# EAGLE board Mainboard v4 (EAGLE 7.2.0), part 1 of 2
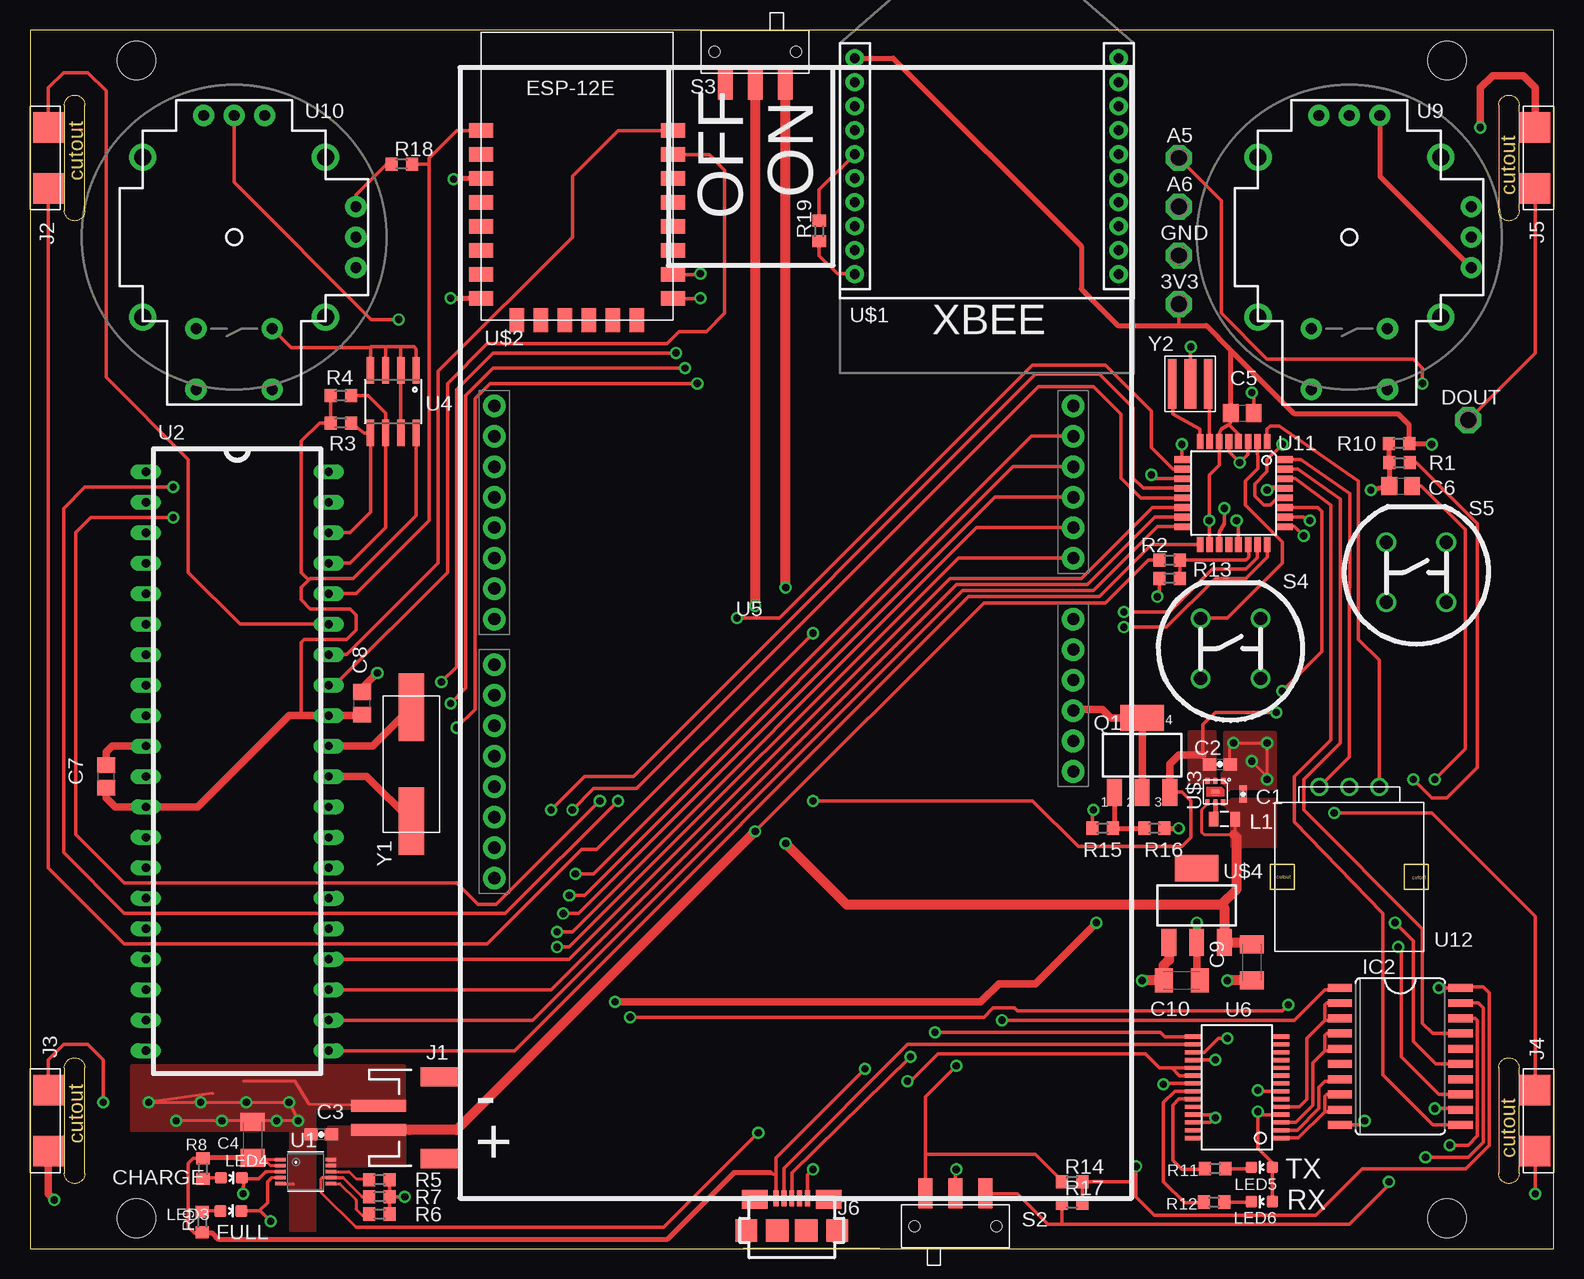
[diagram p2: board, top side]
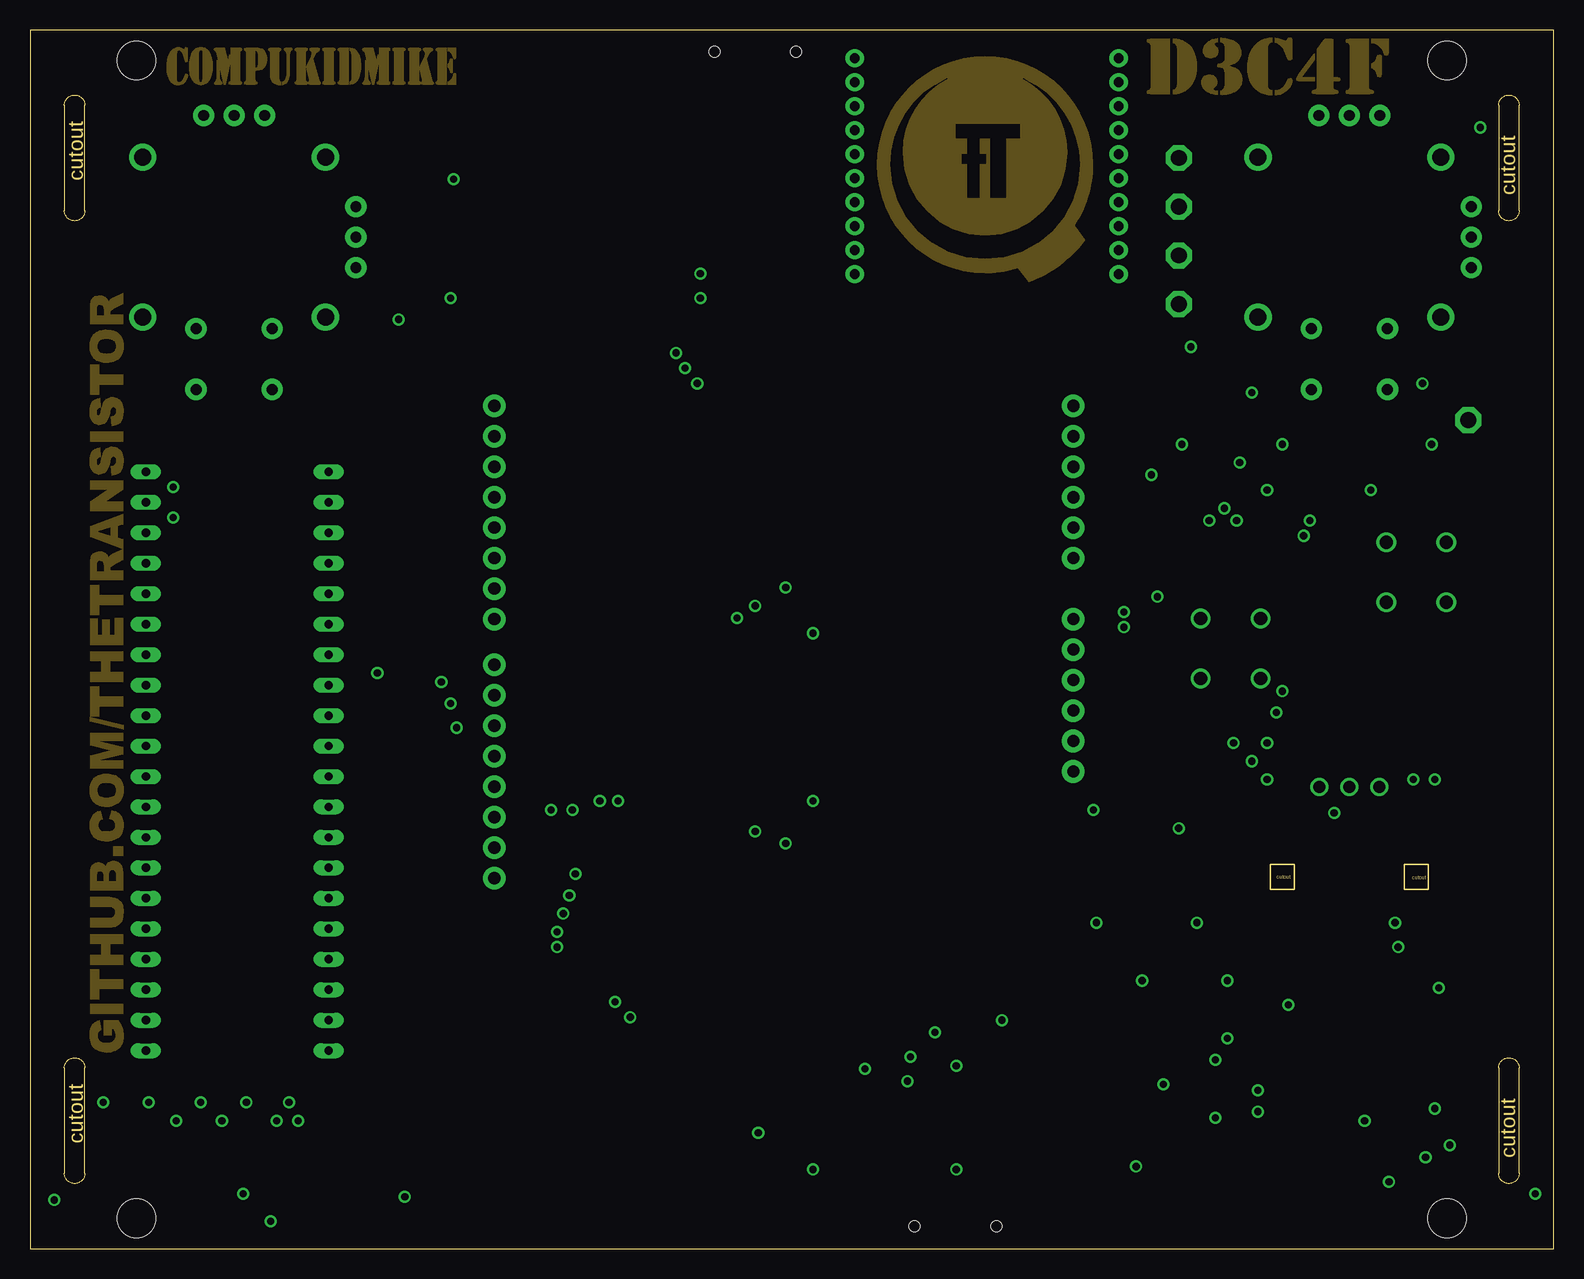
[diagram p3: board, inner layer Route15]
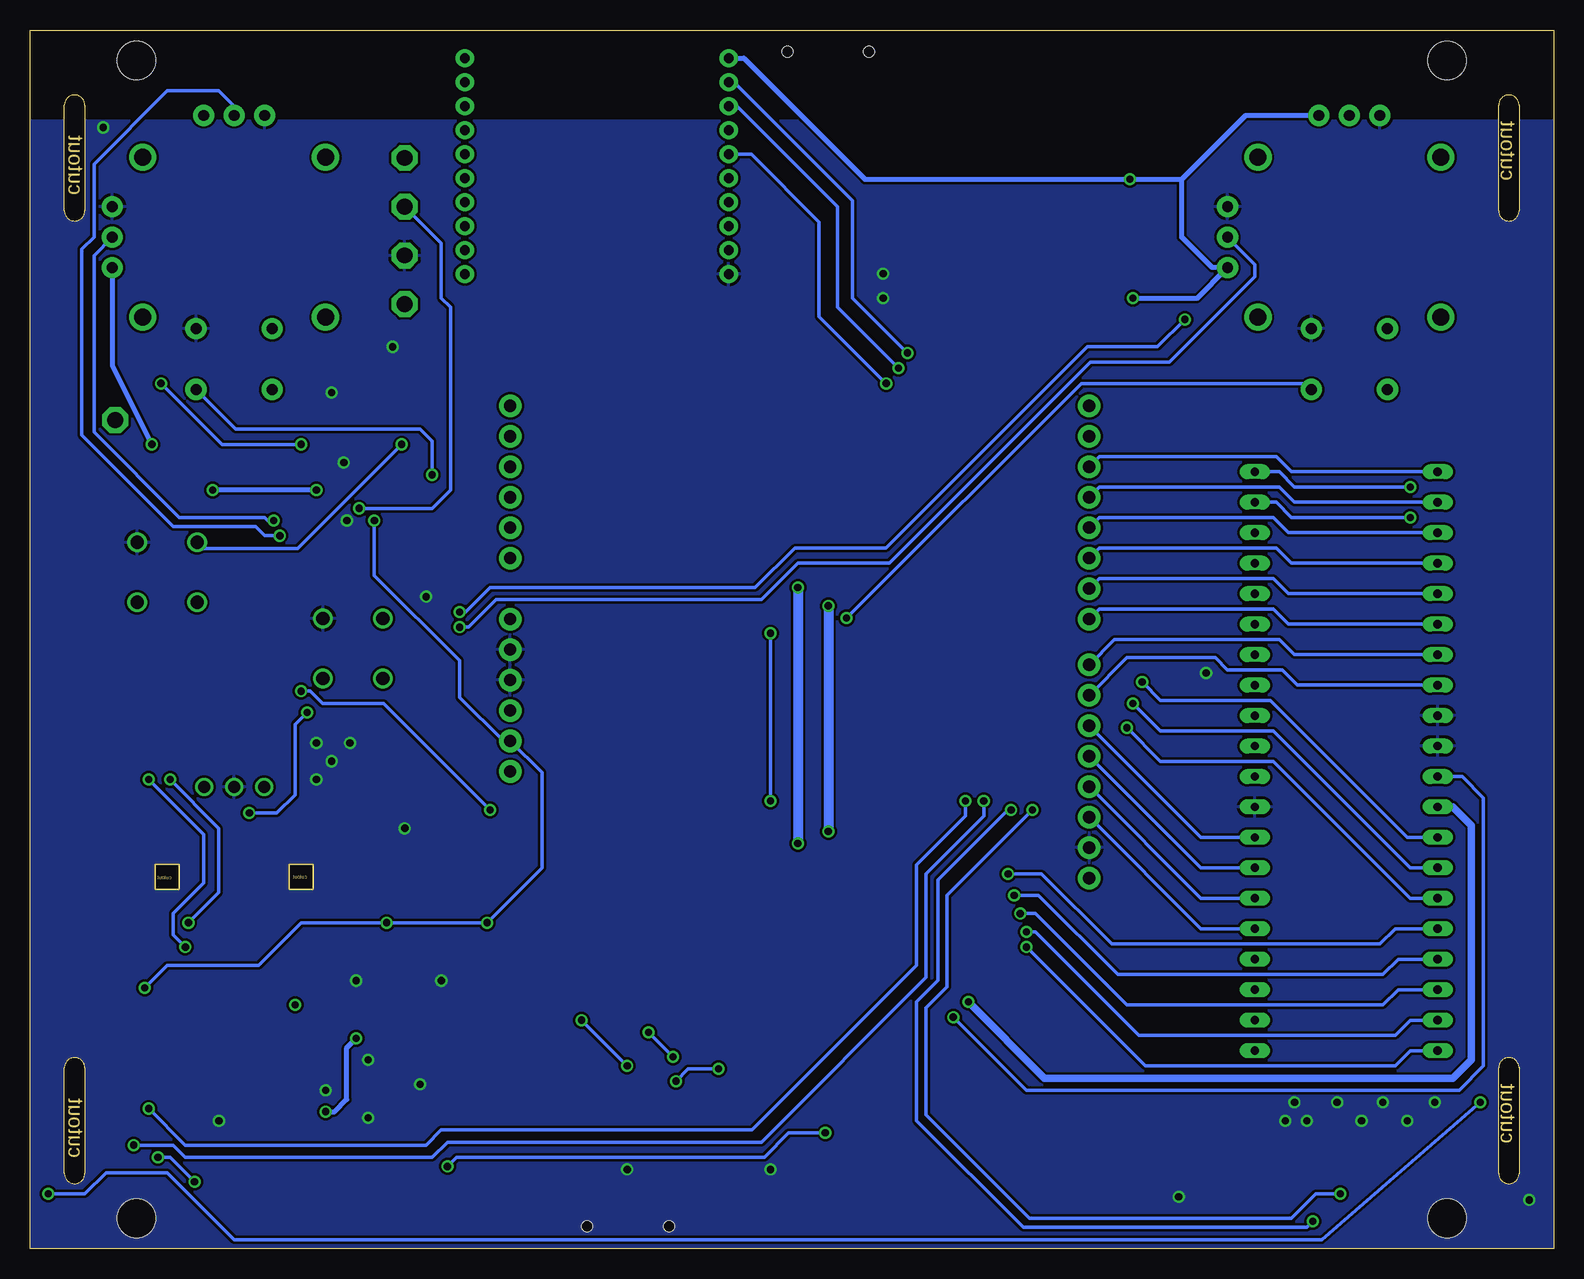
[diagram p4: board, bottom side, seen from below]

Size 127 x 101.6 mm. Coordinates in mm from the lower left corner, seen from the top.
Outline: 0,0 127,0 127,101.6 0,101.6 0,0
Copper layers (1+2*14+15+16): Top 0.035mm / dielectric 1.5mm / Route2 0.035mm / dielectric 0.15mm / Route14 0.035mm / dielectric 0.15mm / Route15 0.035mm / dielectric 0.2mm / Bottom 0.035mm
Design rules "default *": minimum track width 10mil, minimum drill 12mil, track to track 8mil, track to pad 8mil, pad to pad 6mil, via to via 8mil, smd to smd 8mil, copper to edge 0.002540625mm, drill to drill 8mil, minimum pad ring 10mil, minimum via ring 8mil, stop-mask expansion 4mil, vias tented up to drill 0mil, thermal gap 10mil
Holes 3.2 mm at 8.89,99.06 118.11,99.06 118.11,2.54 8.89,2.54

## Footprints (pad centres in the part's own frame; a part is rotated, then mirrored left to right if it is on the bottom)
P1-13 = drill 1.321 pad 2.159 octagon: TP 0,0
0402-CAP = smd 0.45 x 0.6: 1 -0.48,0; 2 0.49,0
0603-CAP = smd 1.1 x 1: 1 -0.85,0; 2 0.85,0
C1206K = smd 1.5 x 2: 1 -1.5,0; 2 1.5,0
C0805 = smd 1.3 x 1.5: 1 -0.95,0; 2 0.95,0
SO20W = smd 0.66 x 2.032: 1 -5.715,-5.029; 2 -4.445,-5.029; 3 -3.175,-5.029; 4 -1.905,-5.029; 5 -0.635,-5.029; 6 0.635,-5.029; 7 1.905,-5.029; 8 3.175,-5.029; 9 4.445,-5.029; 10 5.715,-5.029; 11 5.715,5.029; 12 4.445,5.029; 13 3.175,5.029; 14 1.905,5.029; 15 0.635,5.029; 16 -0.635,5.029; 17 -1.905,5.029; 18 -3.175,5.029; 19 -4.445,5.029; 20 -5.715,5.029
JST-2-SMD = smd 1 x 4.6: 1 -1,-3.7; 2 1,-3.7 | smd 1.6 x 3.4: NC1 -3.4,1.5; NC2 3.4,1.5
SMD-2-SMALL = smd 2.54 x 2.54: P$1 -2.54,0.254; P$2 2.54,0.254
CON2_USB_MICRO_B_AT = smd 0.406 x 1.346: P1 -1.321,2.692; P2 -0.66,2.692; P3 0,2.692; P4 0.66,2.692; P5 1.321,2.692 | smd 1.8 x 1.9: S1 -3.802,0; S2 3.802,0 | smd 2.1 x 1.6: S3 -3.089,2.592; S4 3.089,2.592 | smd 1.9 x 1.9: S5 -1.216,0; S6 1.216,0
0805 = smd 0.8 x 1.2: 1 -0.9,0; 2 0.9,0
LED-0603 = smd 1 x 1: A 0,-0.877; C 0,0.877
SOT223 = smd 1.219 x 2.235: 1 -2.311,-3.099; 2 0,-3.099; 3 2.311,-3.099 | smd 3.6 x 2.2: 4 0,3.099
R0603 = smd 1 x 1.1: 1 -0.85,0; 2 0.85,0
SAQN = smd 1.2 x 2.5: 1 -2.5,1.25; 2 0,1.25; 3 2.5,1.25 | hole 0.9: -3.4,-1.5; 3.4,-1.5
TACTILE-PTH-LARGE = drill 1.1: P$1 -2.5,2.5; P$2 2.5,2.5; P$3 2.5,-2.5; P$4 -2.5,-2.5
MSOP-10 = smd 0.305 x 0.889: 1 -1,-2.11; 2 -0.5,-2.11; 3 0,-2.11; 4 0.5,-2.11; 5 1,-2.11; 6 1,2.11; 7 0.5,2.11; 8 0,2.11; 9 -0.5,2.11; 10 -1,2.11
DIP-40 = drill 0.7 pad 1.27 long: 1 -7.62,24.13; 2 -7.62,21.59; 3 -7.62,19.05; 4 -7.62,16.51; 5 -7.62,13.97; 6 -7.62,11.43; 7 -7.62,8.89; 8 -7.62,6.35; 9 -7.62,3.81; 10 -7.62,1.27; 11 -7.62,-1.27; 12 -7.62,-3.81; 13 -7.62,-6.35; 14 -7.62,-8.89; 15 -7.62,-11.43; 16 -7.62,-13.97; 17 -7.62,-16.51; 18 -7.62,-19.05; 19 -7.62,-21.59; 20 -7.62,-24.13; 21 7.62,-24.13; 22 7.62,-21.59; 23 7.62,-19.05; 24 7.62,-16.51; 25 7.62,-13.97; 26 7.62,-11.43; 27 7.62,-8.89; 28 7.62,-6.35; 29 7.62,-3.81; 30 7.62,-1.27; 31 7.62,1.27; 32 7.62,3.81; 33 7.62,6.35; 34 7.62,8.89; 35 7.62,11.43; 36 7.62,13.97; 37 7.62,16.51; 38 7.62,19.05; 39 7.62,21.59; 40 7.62,24.13
SO08 = smd 0.61 x 2.21: 1 -1.905,-2.616; 2 -0.635,-2.616; 3 0.635,-2.616; 4 1.905,-2.616; 5 1.905,2.616; 6 0.635,2.616; 7 -0.635,2.616; 8 -1.905,2.616
3.6TFT-LCD-SHIELD = drill 1.016 pad 1.88: 3.3V 49.63,12.61; 5V 49.63,15.15; A0 49.63,27.85; A1 49.63,30.39; A2 49.63,32.93; A3 49.63,35.47; A4 49.63,38.01; A5 49.63,40.55; AREF 1.37,1.18; D2 1.37,35.47; D3 1.37,32.93; D4 1.37,30.39; D5 1.37,27.85; D6 1.37,25.31; D7 1.37,22.77; D8 1.37,18.96; D9 1.37,16.42; D10 1.37,13.88; D11 1.37,11.34; D12 1.37,8.8; D13 1.37,6.26; GND@0 49.63,17.69; GND@1 49.63,20.23; GND@2 1.37,3.72; RES 49.63,10.07; RX 1.37,40.55; TX 1.37,38.01; VIN 49.63,22.77
SSOP28DB = smd 0.348 x 1.397: 1 -4.225,-3.656; 2 -3.575,-3.656; 3 -2.925,-3.656; 4 -2.275,-3.656; 5 -1.625,-3.656; 6 -0.975,-3.656; 7 -0.325,-3.656; 8 0.325,-3.656; 9 0.975,-3.656; 10 1.625,-3.656; 11 2.275,-3.656; 12 2.925,-3.656; 13 3.575,-3.656; 14 4.225,-3.656; 15 4.225,3.656; 16 3.575,3.656; 17 2.925,3.656; 18 2.275,3.656; 19 1.625,3.656; 20 0.975,3.656; 21 0.325,3.656; 22 -0.325,3.656; 23 -0.975,3.656; 24 -1.625,3.656; 25 -2.275,3.656; 26 -2.925,3.656; 27 -3.575,3.656; 28 -4.225,3.656
JOYSTICK = drill 0.9 pad 1.778: B1A -3.175,12.7; B1B 3.175,12.7; B2A -3.175,7.62; B2B 3.175,7.62 | drill 0.889 pad 1.778: H1 -2.54,-10.16; H2 0,-10.16; H3 2.54,-10.16; V1 -10.16,2.54; V2 -10.16,0; V3 -10.16,-2.54 | drill 1.397 pad 2.286: MOUNT1 -7.62,6.668; MOUNT2 -7.62,-6.668; MOUNT3 7.62,-6.668; MOUNT4 7.62,6.668
TQFP32-08 = smd 1.27 x 0.559: 1 -4.293,2.8; 2 -4.293,2; 3 -4.293,1.2; 4 -4.293,0.4; 5 -4.293,-0.4; 6 -4.293,-1.2; 7 -4.293,-2; 8 -4.293,-2.8; 17 4.293,-2.8; 18 4.293,-2; 19 4.293,-1.2; 20 4.293,-0.4; 21 4.293,0.4; 22 4.293,1.2; 23 4.293,2; 24 4.293,2.8 | smd 0.559 x 1.27: 9 -2.8,-4.293; 10 -2,-4.293; 11 -1.2,-4.293; 12 -0.4,-4.293; 13 0.4,-4.293; 14 1.2,-4.293; 15 2,-4.293; 16 2.8,-4.293; 25 2.8,4.293; 26 2,4.293; 27 1.2,4.293; 28 0.4,4.293; 29 -0.4,4.293; 30 -1.2,4.293; 31 -2,4.293; 32 -2.8,4.293
ENCODER-12MM-VERT-SQ = drill 1: P$1 -2.5,-7.5; P$2 0,-7.5; P$3 2.5,-7.5
XBEE-SILK = drill 0.8 pad 1.524: 1 -11,20; 2 -11,18; 3 -11,16; 4 -11,14; 5 -11,12; 6 -11,10; 7 -11,8; 8 -11,6; 9 -11,4; 10 -11,2; 11 11,2; 12 11,4; 13 11,6; 14 11,8; 15 11,10; 16 11,12; 17 11,14; 18 11,16; 19 11,18; 20 11,20
ESP8266-ESP12E = smd 2 x 1.2: 1 16,1.8; 2 16,3.8; 3 16,5.8; 4 16,7.8; 5 16,9.8; 6 16,11.8; 7 16,13.8; 8 16,15.8; 9 0,15.8; 10 0,13.8; 11 0,11.8; 12 0,9.8; 13 0,7.8; 14 0,5.8; 15 0,3.8; 16 0,1.8 | smd 1.2 x 2: P$1 13,0; P$2 11,0; P$3 9,0; P$4 7,0; P$5 5,0; P$6 3,0
6-UMLP = smd 0.35 x 0.5: P$1 -0.65,-0.9; P$2 0,-0.9; P$3 0.65,-0.9; P$4 0.65,0.9; P$5 0,0.9; P$6 -0.65,0.9 | smd 0.61 x 0.305: THERMAL 0,0
CRYSTAL-SMD = smd 5.6 x 2.1: P$1 -4.75,0; P$2 4.75,0
RESONATOR-AWSCR-CV = smd 0.7 x 4.1: P$1 -1.5,0; P$3 1.5,0 | smd 1 x 4.1: P$2 0,0

## Placement (x,y rotation side)
3V3  TPPAD1-13  [P1-13]  95.76,78.74 0 top
A5  TPPAD1-13  [P1-13]  95.76,90.93 0 top
A6  TPPAD1-13  [P1-13]  95.76,86.87 0 top
C1  2.2uF  [0402-CAP]  101.13,37.91 270 top
C2  4.7uF  [0603-CAP]  99.19,40.39 0 top
C3  4.7uF  [0603-CAP]  24.28,9.52 180 top
C4  10uF  [C1206K]  18.56,9.06 90 top
C5  0.1uF  [C0805]  101.06,69.67 0 top
C6  0.1uF  [C0805]  114.26,63.59 0 top
C7  0.1uF  [C0805]  6.35,39.37 90 top
C8  0.1uF  [C0805]  27.69,45.47 90 top
C9  1uF  [C1206K]  101.85,23.88 270 top
C10  1uF  [C1206K]  96.01,22.35 180 top
DOUT  TPPAD1-13  [P1-13]  119.89,69.09 0 top
GND  TPPAD1-13  [P1-13]  95.76,82.8 0 top
IC2  74LS244DW  [SO20W]  114.22,16.03 270 top
J1  [JST-2-SMD]  32.77,10.92 270 top
J2  BOARD-EDGE-CONN-SMDSMALL  [SMD-2-SMALL]  1.27,90.93 270 top
J3  BOARD-EDGE-CONN-SMDSMALL  [SMD-2-SMALL]  1.27,10.67 270 top
J4  BOARD-EDGE-CONN-SMDSMALL  [SMD-2-SMALL]  125.73,10.67 90 top
J5  BOARD-EDGE-CONN-SMDSMALL  [SMD-2-SMALL]  125.73,90.93 90 top
J6  MYCON2_USB-MINI-B  [CON2_USB_MICRO_B_AT]  63.5,1.52 0 top
L1  [0805]  99.57,35.81 180 top
LED3  GRN  [LED-0603]  16.74,3.14 270 top
LED4  RED  [LED-0603]  16.79,5.91 270 top
LED5  GRN  [LED-0603]  102.69,6.79 90 top
LED6  GRN  [LED-0603]  102.69,3.93 90 top
Q1  BSP170P  [SOT223]  92.71,41.15 0 top
R1  10K  [R0603]  114.16,65.53 0 top
R2  10K  [R0603]  95,57.4 180 top
R3  10K  [R0603]  25.91,68.83 180 top
R4  10K  [R0603]  25.91,71.12 180 top
R5  10K  [R0603]  29.14,5.76 180 top
R6  2K  [R0603]  29.14,2.89 180 top
R7  10K  [R0603]  29.14,4.34 180 top
R8  360  [R0603]  14.41,6.67 90 top
R9  360  [R0603]  14.37,2.24 270 top
R10  10K  [R0603]  114.12,67.13 0 top
R11  360  [R0603]  98.79,6.68 180 top
R12  360  [R0603]  98.71,3.89 180 top
R13  20K  [R0603]  95,55.88 0 top
R14  10K  [R0603]  86.87,5.59 0 top
R15  10R  [R0603]  89.41,35.05 0 top
R16  10K  [R0603]  93.73,35.05 180 top
R17  10K  [R0603]  86.87,3.81 0 top
R18  10K  [R0603]  30.99,90.42 0 top
R19  10K  [R0603]  65.79,84.84 90 top
S2  JS102011SAQN  [SAQN]  77.14,3.36 0 top
S3  JS102011SAQN  [SAQN]  60.45,98.3 180 top
S4  SWITCH-MOMENTARY-2PTH-LARGE  [TACTILE-PTH-LARGE]  100.08,50.04 0 top
S5  SWITCH-MOMENTARY-2PTH-LARGE  [TACTILE-PTH-LARGE]  115.57,56.39 0 top
U1  MCP73833  [MSOP-10]  22.98,6.42 270 top
U2  P8X32A-D40  [DIP-40]  17.27,40.64 0 top
U4  EEPROM-I2CSMD  [SO08]  30.28,70.62 180 top
U5  ARDUINO_SHIELD3.5LCD  [3.6TFT-LCD-SHIELD]  37.34,29.72 0 top
U6  FT232RLSSOP  [SSOP28DB]  100.61,13.45 90 top
U9  JOYSTICKPTH-RIGHT  [JOYSTICK]  109.98,84.33 180 top
U10  JOYSTICKPTH-LEFT  [JOYSTICK]  17.02,84.33 180 top
U11  ATMEGA328P  [TQFP32-08]  100.33,62.99 270 top
U12  [ENCODER-12MM-VERT-SQ]  109.98,30.99 180 top
U$1  XBEE-1B2  [XBEE-SILK]  79.76,79.25 0 top
U$2  ESP8266_ESP-12  [ESP8266-ESP12E]  37.59,77.42 0 top
U$3  FAN4860  [6-UMLP]  98.81,38.1 180 top
U$4  V_REG_AP2114H-3.3  [SOT223]  97.25,28.63 0 top
Y1  5MHz  [CRYSTAL-SMD]  31.8,40.4 90 top
Y2  8MHZ  [RESONATOR-AWSCR-CV]  96.72,72.09 180 top